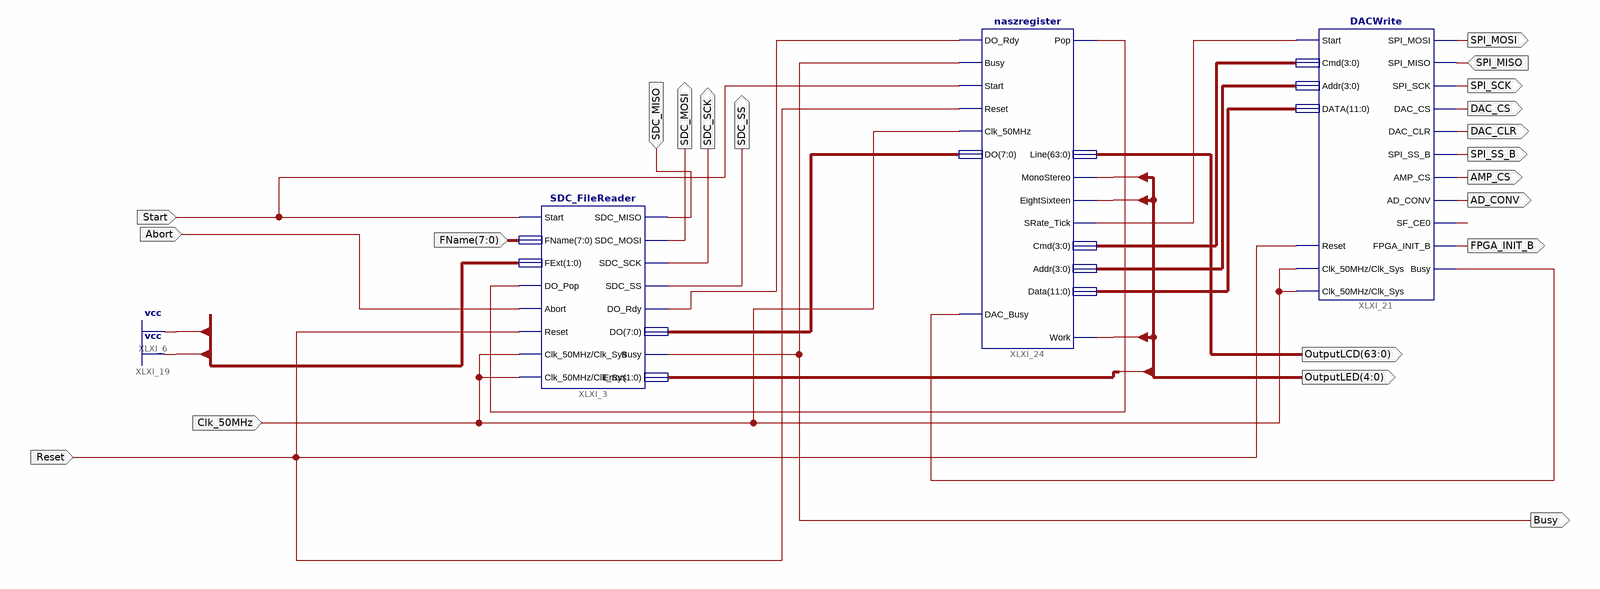
[diagram p0: schematic sheet 1]
// Xilinx ISE schematic WAV_reader.sch (spartan3e) as structural Verilog: 3 symbols, 21 ports
module WAV_reader (
  input  SDC_MISO,
  input  Abort,
  input  SPI_MISO,
  input  Clk_50MHz,
  input  Start,
  input  [7:0] FName,
  input  Reset,
  output SDC_MOSI,
  output SDC_SS,
  output SDC_SCK,
  output [63:0] OutputLCD,
  output SPI_MOSI,
  output SPI_SCK,
  output DAC_CS,
  output DAC_CLR,
  output SPI_SS_B,
  output AMP_CS,
  output AD_CONV,
  output FPGA_INIT_B,
  output Busy,
  output [4:0] OutputLED
);

  wire XLXN_84, XLXN_87, XLXN_93, XLXN_95, XLXN_104;
  wire [3:0] XLXN_88, XLXN_89;
  wire [7:0] XLXN_85;
  wire [11:0] XLXN_90;

  SDC_FileReader XLXI_3 (
    .SDC_MISO(SDC_MISO), .Start(Start), .FName(FName), .Reset(Reset), .Clk_50MHz(Clk_50MHz),
    .DO_Pop(XLXN_87), .Abort(Abort), .SDC_MOSI(SDC_MOSI), .SDC_SCK(SDC_SCK), .SDC_SS(SDC_SS),
    .Error(OutputLED[1:0]), .DO(XLXN_85), .DO_Rdy(XLXN_84), .Busy(Busy), .FExt(2'b11), .Clk_Sys(Clk_50MHz));
  DACWrite XLXI_21 (
    .Reset(Reset), .Start(XLXN_93), .SPI_MISO(SPI_MISO), .Cmd(XLXN_88), .Addr(XLXN_89), .DATA(XLXN_90),
    .DAC_CLR(DAC_CLR), .DAC_CS(DAC_CS), .SPI_MOSI(SPI_MOSI), .SPI_SCK(SPI_SCK), .SPI_SS_B(SPI_SS_B),
    .AMP_CS(AMP_CS), .AD_CONV(AD_CONV), .SF_CE0(XLXN_104), .FPGA_INIT_B(FPGA_INIT_B), .Busy(XLXN_95),
    .Clk_50MHz(Clk_50MHz), .Clk_Sys(Clk_50MHz));
  naszregister XLXI_24 (
    .DO_Rdy(XLXN_84), .Busy(Busy), .DAC_Busy(XLXN_95), .Start(Start), .Reset(Reset), .Clk_50MHz(Clk_50MHz),
    .DO(XLXN_85), .Pop(XLXN_87), .MonoStereo(OutputLED[2]), .EightSixteen(OutputLED[3]),
    .SRate_Tick(XLXN_93), .Cmd(XLXN_88), .Addr(XLXN_89), .Data(XLXN_90), .Line(OutputLCD), .Work(OutputLED[4]));
endmodule
